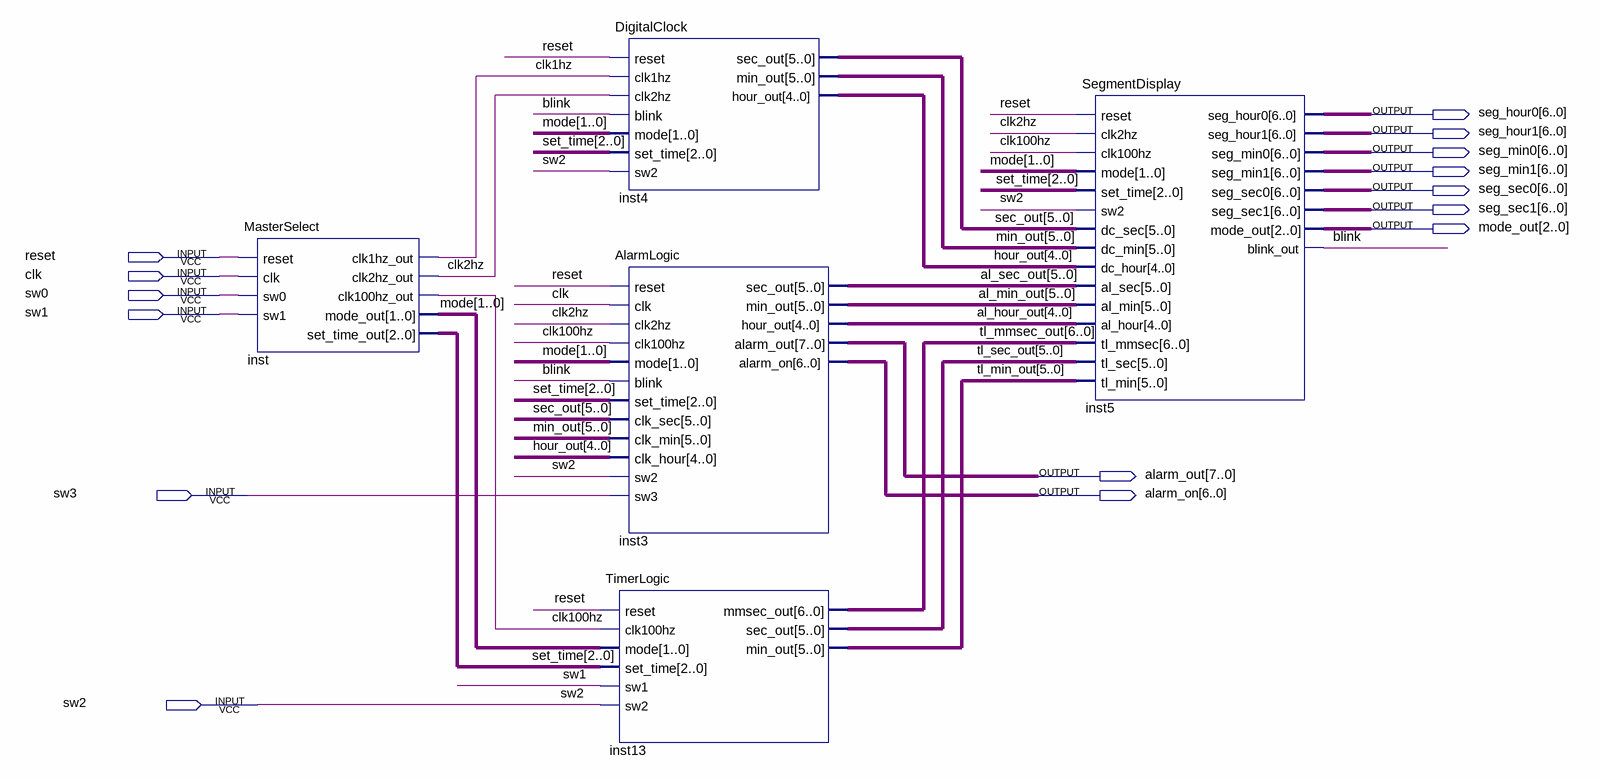
[diagram p0: schematic sheet]
// Quartus schematic DigitalWatch.bdf as structural Verilog: 5 symbols, 15 pins
module DigitalWatch (
  input  reset,
  input  clk,
  input  sw0,
  input  sw1,
  input  sw3,
  input  sw2,
  output [6:0] seg_hour0,
  output [6:0] seg_hour1,
  output [6:0] seg_min0,
  output [6:0] seg_min1,
  output [6:0] seg_sec0,
  output [6:0] seg_sec1,
  output [2:0] mode_out,
  output [7:0] alarm_out,
  output [6:0] alarm_on
);

  wire blink, clk1hz, clk2hz, clk100hz;
  wire [1:0] mode;
  wire [2:0] set_time;
  wire [4:0] al_hour_out, hour_out;
  wire [5:0] al_min_out, al_sec_out, min_out, sec_out, tl_min_out, tl_sec_out;
  wire [6:0] tl_mmsec_out;

  MasterSelect inst (
    .reset(reset), .clk(clk), .sw0(sw0), .sw1(sw1), .clk1hz_out(clk1hz), .clk2hz_out(clk2hz),
    .clk100hz_out(clk100hz), .mode_out(mode), .set_time_out(set_time));
  TimerLogic inst13 (
    .reset(reset), .clk100hz(clk100hz), .mode(mode), .set_time(set_time), .sw1(sw1), .sw2(sw2),
    .mmsec_out(tl_mmsec_out), .sec_out(tl_sec_out), .min_out(tl_min_out));
  DigitalClock inst4 (
    .reset(reset), .clk1hz(clk1hz), .clk2hz(clk2hz), .blink(blink), .mode(mode), .set_time(set_time),
    .sw2(sw2), .sec_out(sec_out), .min_out(min_out), .hour_out(hour_out));
  AlarmLogic inst3 (
    .reset(reset), .clk(clk), .clk2hz(clk2hz), .clk100hz(clk100hz), .mode(mode), .blink(blink),
    .set_time(set_time), .clk_sec(sec_out), .clk_min(min_out), .clk_hour(hour_out), .sw2(sw2), .sw3(sw3),
    .sec_out(al_sec_out), .min_out(al_min_out), .hour_out(al_hour_out), .alarm_out(alarm_out),
    .alarm_on(alarm_on));
  SegmentDisplay inst5 (
    .reset(reset), .clk2hz(clk2hz), .clk100hz(clk100hz), .mode(mode), .set_time(set_time), .sw2(sw2),
    .dc_sec(sec_out), .dc_min(min_out), .dc_hour(hour_out), .al_sec(al_sec_out), .al_min(al_min_out),
    .al_hour(al_hour_out), .tl_mmsec(tl_mmsec_out), .tl_sec(tl_sec_out), .tl_min(tl_min_out),
    .seg_hour0(seg_hour0), .seg_hour1(seg_hour1), .seg_min0(seg_min0), .seg_min1(seg_min1),
    .seg_sec0(seg_sec0), .seg_sec1(seg_sec1), .mode_out(mode_out), .blink_out(blink));
endmodule
